# EAGLE design hd2 (EAGLE 6.3)

## Sheet 1 of 2
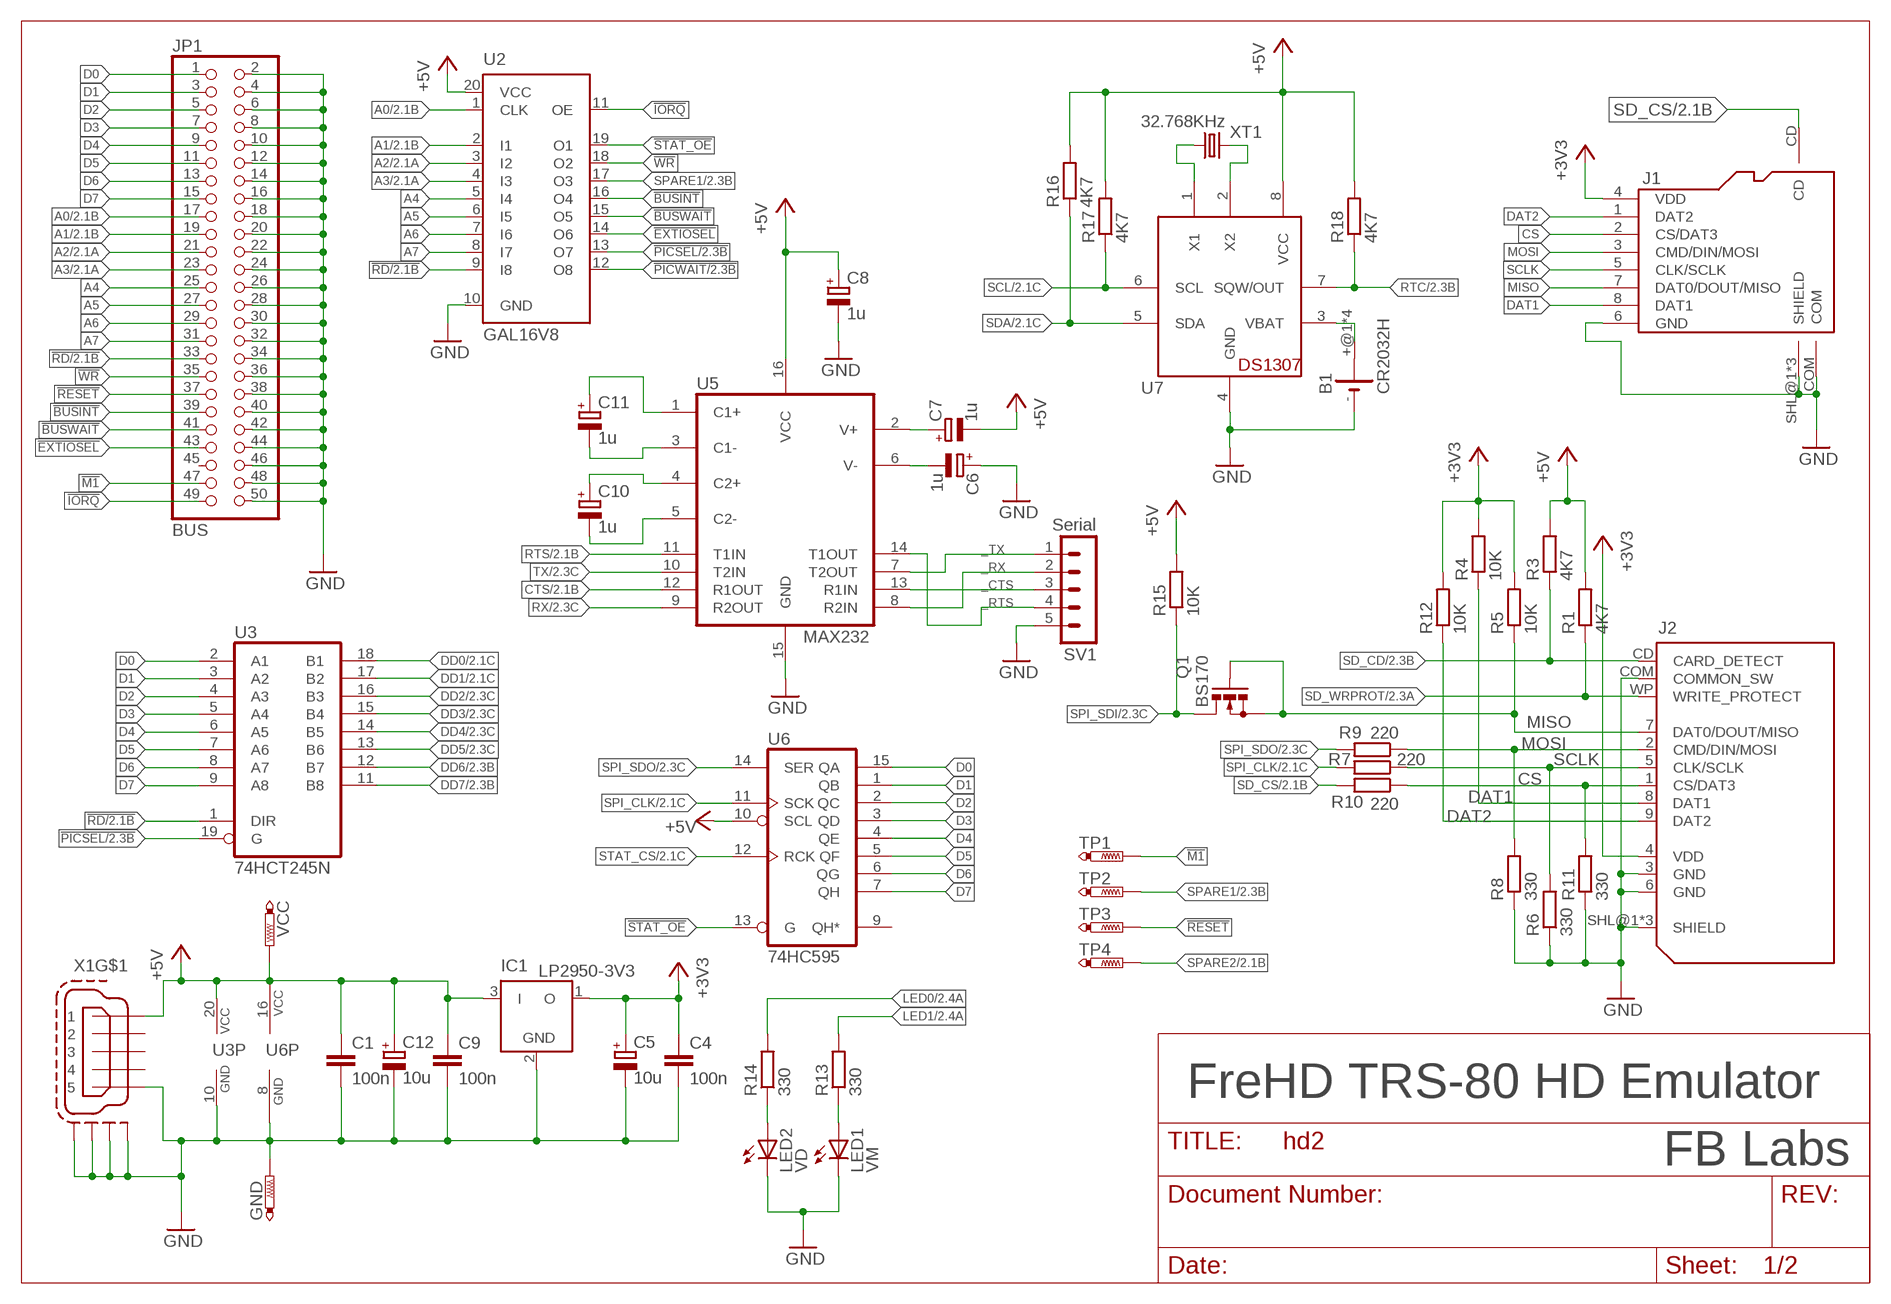
[diagram p0: schematic, sheet 1]

### Parts
B1  CR2032H  [CR2032H]
C1  100n  C-EU050-024X044  [C050-024X044]
C4  100n  C-EU050-024X044  [C050-024X044]
C5  10u  CPOL-EUE2-4  [E2-4]
C6  1u  CPOL-EUE2-4  [E2-4]
C7  1u  CPOL-EUE2-4  [E2-4]
C8  1u  CPOL-EUE2-4  [E2-4]
C9  100n  C-EU050-024X044  [C050-024X044]
C10  1u  CPOL-EUE2-4  [E2-4]
C11  1u  CPOL-EUE2-4  [E2-4]
C12  10u  CPOL-EUE2-4  [E2-4]
GND  PTR1B2,54  [B2,54]
IC1  LP2950-3V3  LP2950Z  [TO92]
J1  MICROSD-9P  [9P-SMD-W/-RING]
J2  SDMMC06132  [06132]
JP1  BUS  PINHD-2X25  [2X25]
LED1  VM  LED3MM  [LED3MM]
LED2  VD  LED3MM  [LED3MM]
Q1  BS170  [SOT54E]
R1  4K7  R-EU_0207/10  [0207/10]
R3  4K7  R-EU_0207/10  [0207/10]
R4  10K  R-EU_0207/10  [0207/10]
R5  10K  R-EU_0207/10  [0207/10]
R6  330  R-EU_0207/10  [0207/10]
R7  220  R-EU_0207/10  [0207/10]
R8  330  R-EU_0207/10  [0207/10]
R9  220  R-EU_0207/10  [0207/10]
R10  220  R-EU_0207/10  [0207/10]
R11  330  R-EU_0207/10  [0207/10]
R12  10K  R-EU_0207/10  [0207/10]
R13  330  R-EU_0207/10  [0207/10]
R14  330  R-EU_0207/10  [0207/10]
R15  10K  R-EU_0207/10  [0207/10]
R16  4K7  R-EU_0207/10  [0207/10]
R17  4K7  R-EU_0207/10  [0207/10]
R18  4K7  R-EU_0207/10  [0207/10]
SV1  Serial  MA05-1  [MA05-1]
TP1  PTR1PAD1-10  [P1-10]
TP2  PTR1PAD1-10  [P1-10]
TP3  PTR1PAD1-10  [P1-10]
TP4  PTR1PAD1-10  [P1-10]
U2  GAL16V8  ATF16V8BP3  [DIL20]
U3  74HCT245N  [DIL20]
U5  MAX232  MAX232PTH  [DIL16]
U6  74HC595  74LS595N  [DIL16]
U7  DS1307  [DIL08]
VCC  PTR1B2,54  [B2,54]
X1  MINI-USB-SCHIELD-32005-301  [32005-301]
XT1  32.768KHz  CRYSTALTC26V  [TC26V]

### Nets
!BUSINT: JP1.39 U2.16(O4)
!BUSWAIT: JP1.41 U2.15(O5)
!EXTIOSEL: JP1.43 U2.14(O6)
!IORQ: JP1.49 U2.11(OE)
!M1: JP1.47 TP1.TP
!PICSEL: U2.13(O7) U3.19(G) ; also sheet 2
!PICWAIT: U2.12(O8) ; also sheet 2
!RD: JP1.33 U2.9(I8) U3.1(DIR) ; also sheet 2
!RESET: JP1.37 TP3.TP
!STAT_OE: U2.19(O1) U6.13(G)
!WR: JP1.35 U2.18(O2)
+3V3 [power]: C4.1 C5.+ IC1.1(O) J1.4(VDD) J2.4(VDD) R4.2 R5.2 R12.2
+5V [power]: C1.1 C7.- C8.+ C9.1 C12.+ IC1.3(I) R1.2 R3.2 R15.2 R16.2 R17.2 R18.2 U2.20(VCC) U3.20(VCC) U5.16(VCC) U6.10(SCL) U6.16(VCC) U7.8(VCC) VCC.TP X1.1 ; also sheet 2
_CTS: SV1.3 U5.13(R1IN)
_RTS: SV1.4 U5.14(T1OUT)
_RX: SV1.2 U5.8(R2IN)
_TX: SV1.1 U5.7(T2OUT)
A0: JP1.17 U2.1(CLK) ; also sheet 2
A1: JP1.19 U2.2(I1) ; also sheet 2
A2: JP1.21 U2.3(I2) ; also sheet 2
A3: JP1.23 U2.4(I3) ; also sheet 2
A4: JP1.25 U2.5(I4)
A5: JP1.27 U2.6(I5)
A6: JP1.29 U2.7(I6)
A7: JP1.31 U2.8(I7)
CS: J1.2(CS/DAT3) J2.1(CS/DAT3) R10.1 R11.2
CTS: U5.12(R1OUT) ; also sheet 2
D0: JP1.1 U3.2(A1) U6.15(QA)
D1: JP1.3 U3.3(A2) U6.1(QB)
D2: JP1.5 U3.4(A3) U6.2(QC)
D3: JP1.7 U3.5(A4) U6.3(QD)
D4: JP1.9 U3.6(A5) U6.4(QE)
D5: JP1.11 U3.7(A6) U6.5(QF)
D6: JP1.13 U3.8(A7) U6.6(QG)
D7: JP1.15 U3.9(A8) U6.7(QH)
DAT1: J1.8(DAT1) J2.8(DAT1) R4.1
DAT2: J1.1(DAT2) J2.9(DAT2) R12.1
DD0: U3.18(B1) ; also sheet 2
DD1: U3.17(B2) ; also sheet 2
DD2: U3.16(B3) ; also sheet 2
DD3: U3.15(B4) ; also sheet 2
DD4: U3.14(B5) ; also sheet 2
DD5: U3.13(B6) ; also sheet 2
DD6: U3.12(B7) ; also sheet 2
DD7: U3.11(B8) ; also sheet 2
GND [power]: B1.- C1.2 C4.2 C5.- C6.+ C8.- C9.2 C12.- GND.TP IC1.2(GND) J1.6(GND) J1.COM J1.SHL@1(SHIELD) J1.SHL@2(SHIELD) J1.SHL@3(SHIELD) J2.3(GND) J2.6(GND) J2.COM(COMMON_SW) J2.SHL@1(SHIELD) J2.SHL@2(SHIELD) J2.SHL@3(SHIELD) JP1.2 JP1.4 JP1.6 JP1.8 JP1.10 JP1.12 JP1.14 JP1.16 JP1.18 JP1.20 JP1.22 JP1.24 JP1.26 JP1.28 JP1.30 JP1.32 JP1.34 JP1.36 JP1.38 JP1.40 JP1.42 JP1.44 JP1.46 JP1.48 JP1.50 LED1.K(C) LED2.K(C) R6.1 R8.1 R11.1 SV1.5 U2.10(GND) U3.10(GND) U5.15(GND) U6.8(GND) U7.4(GND) X1.5 X1.M1(S:S1) X1.M2(S:S2) X1.M3(S:S3) X1.M4(S:S4) ; also sheet 2
LED0: R14.2 ; also sheet 2
LED1: R13.2 ; also sheet 2
MISO: J1.7(DAT0/DOUT/MISO) J2.7(DAT0/DOUT/MISO) Q1.G Q1.S R5.1
MOSI: J1.3(CMD/DIN/MOSI) J2.2(CMD/DIN/MOSI) R8.2 R9.1
N$1: U7.1(X1) XT1.1
N$2: U7.2(X2) XT1.2
N$3: C6.- U5.6(V-)
N$4: C7.+ U5.2(V+)
N$6: B1.+@1(+) B1.+@2(+) B1.+@3(+) B1.+@4(+) U7.3(VBAT)
N$12: C11.- U5.3(C1-)
N$13: C11.+ U5.1(C1+)
N$14: C10.+ U5.4(C2+)
N$15: C10.- U5.5(C2-)
N$18: LED2.A R14.1
N$19: LED1.A R13.1
RTC: R18.1 U7.7(SQW/OUT) ; also sheet 2
RTS: U5.11(T1IN) ; also sheet 2
RX: U5.9(R2OUT) ; also sheet 2
SCL: R17.1 U7.6(SCL) ; also sheet 2
SCLK: J1.5(CLK/SCLK) J2.5(CLK/SCLK) R6.2 R7.1
SD_CD: J2.CD(CARD_DETECT) R3.1 ; also sheet 2
SD_CS: J1.CD R10.2 ; also sheet 2
SD_WRPROT: J2.WP(WRITE_PROTECT) R1.1 ; also sheet 2
SDA: R16.1 U7.5(SDA) ; also sheet 2
SPARE1: TP2.TP U2.17(O3) ; also sheet 2
SPARE2: TP4.TP ; also sheet 2
SPI_CLK: R7.2 U6.11(SCK) ; also sheet 2
SPI_SDI: Q1.D R15.1 ; also sheet 2
SPI_SDO: R9.2 U6.14(SER) ; also sheet 2
STAT_CS: U6.12(RCK) ; also sheet 2
TX: U5.10(T2IN) ; also sheet 2
Unconnected: JP1.45 U6.9(QH*) X1.2 X1.3 X1.4

### Notes on the sheet
- FreHD TRS-80 HD Emulator
- FB Labs

## Sheet 2 of 2
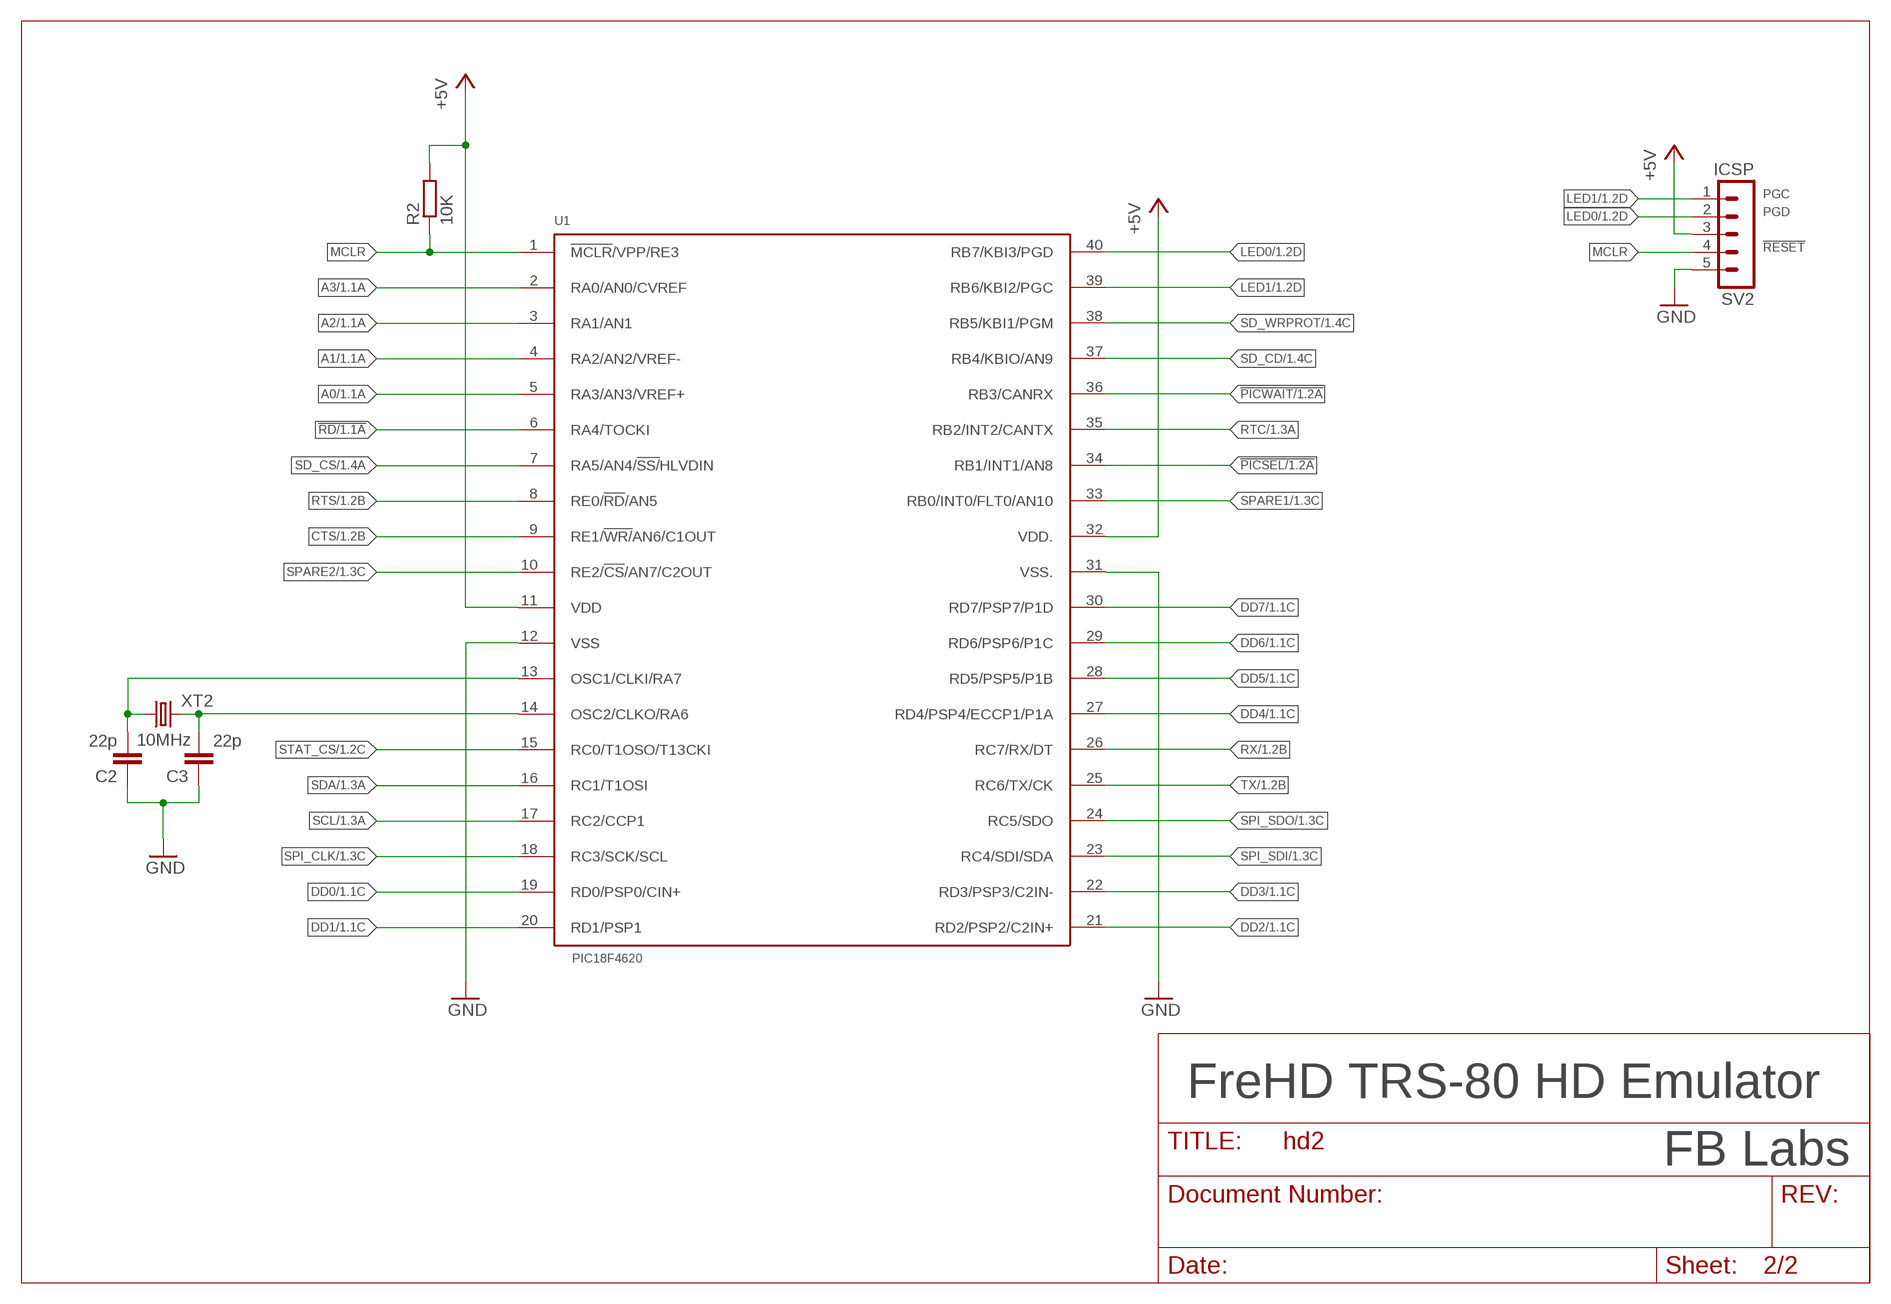
[diagram p1: schematic, sheet 2]

### Parts
C2  22p  C-EU050-024X044  [C050-024X044]
C3  22p  C-EU050-024X044  [C050-024X044]
R2  10K  R-EU_0207/10  [0207/10]
SV2  ICSP  MA05-1  [MA05-1]
U1  PIC18F4620  PIC18F4680  [PDIP-40]
XT2  10MHz  CRYSTALHC49U-V  [HC49U-V]

### Nets
!PICSEL: U1.34(RB1/INT1/AN8) ; also sheet 1
!PICWAIT: U1.36(RB3/CANRX) ; also sheet 1
!RD: U1.6(RA4/TOCKI) ; also sheet 1
+5V [power]: R2.2 SV2.3 U1.11(VDD) U1.32(VDD.) ; also sheet 1
A0: U1.5(RA3/AN3/VREF+) ; also sheet 1
A1: U1.4(RA2/AN2/VREF-) ; also sheet 1
A2: U1.3(RA1/AN1) ; also sheet 1
A3: U1.2(RA0/AN0/CVREF) ; also sheet 1
CTS: U1.9(RE1/!WR/!AN6/C1OUT) ; also sheet 1
DD0: U1.19(RD0/PSP0/CIN+) ; also sheet 1
DD1: U1.20(RD1/PSP1) ; also sheet 1
DD2: U1.21(RD2/PSP2/C2IN+) ; also sheet 1
DD3: U1.22(RD3/PSP3/C2IN-) ; also sheet 1
DD4: U1.27(RD4/PSP4/ECCP1/P1A) ; also sheet 1
DD5: U1.28(RD5/PSP5/P1B) ; also sheet 1
DD6: U1.29(RD6/PSP6/P1C) ; also sheet 1
DD7: U1.30(RD7/PSP7/P1D) ; also sheet 1
GND [power]: C2.1 C3.1 SV2.5 U1.12(VSS) U1.31(VSS.) ; also sheet 1
LED0: SV2.2 U1.40(RB7/KBI3/PGD) ; also sheet 1
LED1: SV2.1 U1.39(RB6/KBI2/PGC) ; also sheet 1
MCLR: R2.1 SV2.4 U1.1(!MCLR!/VPP/RE3)
N$28: C2.2 U1.13(OSC1/CLKI/RA7) XT2.1
N$29: C3.2 U1.14(OSC2/CLKO/RA6) XT2.2
RTC: U1.35(RB2/INT2/CANTX) ; also sheet 1
RTS: U1.8(RE0/!RD!/AN5) ; also sheet 1
RX: U1.26(RC7/RX/DT) ; also sheet 1
SCL: U1.17(RC2/CCP1) ; also sheet 1
SD_CD: U1.37(RB4/KBIO/AN9) ; also sheet 1
SD_CS: U1.7(RA5/AN4/!SS/!HLVDIN) ; also sheet 1
SD_WRPROT: U1.38(RB5/KBI1/PGM) ; also sheet 1
SDA: U1.16(RC1/T1OSI) ; also sheet 1
SPARE1: U1.33(RB0/INT0/FLT0/AN10) ; also sheet 1
SPARE2: U1.10(RE2/!CS!/AN7/C2OUT) ; also sheet 1
SPI_CLK: U1.18(RC3/SCK/SCL) ; also sheet 1
SPI_SDI: U1.23(RC4/SDI/SDA) ; also sheet 1
SPI_SDO: U1.24(RC5/SDO) ; also sheet 1
STAT_CS: U1.15(RC0/T1OSO/T13CKI) ; also sheet 1
TX: U1.25(RC6/TX/CK) ; also sheet 1

### Notes on the sheet
- PGC
- PGD
- !RESET
- FreHD TRS-80 HD Emulator
- FB Labs

## Library data of the parts
B1 = battery2:CR2032H: LI BATTERY Varta
C1-C4 C9 = rcl2:C-EU: CAPACITOR, European symbol
C5-C8 C10-C12 = rcl2:CPOL-EU: POLARIZED CAPACITOR, European symbol
GND VCC = testpad:PTR1: TEST PIN
IC1 = linear:LP2950: 100 mA, Low Power Low Dropout Voltage Regulator Source: http://www.onsemi.com/pub/Collateral/LP2950-D.PDF
J1 = SD-sockets:MICROSD-9P: Micro SD 9 pins
J2 = SD-sockets:SDMMC: SD MMC Card holder 4UCON part #06132 - easy to solder
JP1 = pinhead:PINHD-2X25: PIN HEADER
LED1 LED2 = led:LED: LED OSRAM: - CHIPLED LG R971, LG N971, LY N971, LG Q971, LY Q971, LO R971, LY R971 LH N974, LH R974 LS Q976, LO Q976, LY Q976 LO Q996 - Hyper CHIPLED LW Q18S LB Q993, LB Q99A, LB R99A - SideLED LS A670, LO A670, LY A670, LG A670, LP A670 LB A673, LV A673, LT A673, LW A673 LH A674 LY A675 LS A676, LA A676, LO A676, LY A676, LW A676 LS A679, LY A679, LG A679 - Hyper Micro SIDELED® LS Y876, LA Y876, LO Y876, LY Y876 LT Y87S - SmartLED LW L88C, LW L88S LB L89C, LB L89S, LG L890 LS L89K, LO L89K, LY L89K LS L896, LA L896, LO L896, LY L896 - TOPLED LS T670, LO T670, LY T670, LG T670, LP T670 LSG T670, LSP T670, LSY T670, LOP T670, LYG T670 LG T671, LOG T671, LSG T671 LB T673, LV T673, LT T673, LW T673 LH T674 LS T676, LA T676, LO T676, LY T676, LB T676, LH T676, LSB T676, LW T676 LB T67C, LV T67C, LT T67C, LS T67K, LO T67K, LY T67K, LW E67C LS E67B, LA E67B, LO E67B, LY E67B, LB E67C, LV E67C, LT E67C LW T67C LS T679, LY T679, LG T679 LS T770, LO T770, LY T770, LG T770, LP T770 LB T773, LV T773, LT T773, LW T773 LH T774 LS E675, LA E675, LY E675, LS T675 LS T776, LA T776, LO T776, LY T776, LB T776 LHGB T686 LT T68C, LB T68C - Hyper Mini TOPLED® LB M676 - Mini TOPLED Santana® LG M470 LS M47K, LO M47K, LY M47K Source: http://www.osram.convergy.de LUXEON: - LUMILED® LXK2-PW12-R00, LXK2-PW12-S00, LXK2-PW14-U00, LXK2-PW14-V00 LXK2-PM12-R00, LXK2-PM12-S00, LXK2-PM14-U00 LXK2-PE12-Q00, LXK2-PE12-R00, LXK2-PE12-S00, LXK2-PE14-T00, LXK2-PE14-U00 LXK2-PB12-K00, LXK2-PB12-L00, LXK2-PB12-M00, LXK2-PB14-N00, LXK2-PB14-P00, LXK2-PB14-Q00 LXK2-PR12-L00, LXK2-PR12-M00, LXK2-PR14-Q00, LXK2-PR14-R00 LXK2-PD12-Q00, LXK2-PD12-R00, LXK2-PD12-S00 LXK2-PH12-R00, LXK2-PH12-S00 LXK2-PL12-P00, LXK2-PL12-Q00, LXK2-PL12-R00 Source: www.luxeon.com KINGBRIGHT: KA-3528ASYC Source: www.kingbright.com
Q1 = transistor-small-signal:BS170: N-CHANNEL MOS FET
R1-R18 = rcl2:R-EU_: RESISTOR, European symbol
SV1 SV2 = con-lstb2:MA05-1: PIN HEADER; OC_FARNELL: unknown; OC_NEWARK: unknown
TP1-TP4 = testpad2:PTR1: TEST PIN
U1 = pic18f4680:PIC18F4680
U2 = atmel:ATF16V8B: High perfomance CMOS (electrically erasable) programmable logic device (PLD) ABLE-Atmel-ABEL - P18V8R, P16V8C, P16V8AS, P17V8 COPL Atmel-WinCUPL - G16V8MS, G16V8MA, G16V8AS, G16V8 LOG/IC - GAL16V8_R, GAL16V8_G7, GAL16V8_C), GAL16V8 Tango-PLD - G16V8R, G16V8C, G16V8AS, G16V8 Source: http://www.atmel.com/dyn/resources/prod_documents/DOC0364.PDF; MPN: ATF16V8CZ-15PU; OC_FARNELL: 1551768; OC_NEWARK: 94M6254
U3 = 74xx-eu:74*245: Octal BUS TRANSCEIVER, 3-state
U5 = SparkFun:MAX232: RS232 Transceiver Very common IC. This is generically called 'MAX232', but works with the 3V equivalent MAX3232 generic ICs. Field tested and mother approved. Spark Fun Electronics SKU : COM-00316 (DIP) and COM-00589 (SMD)
U6 = 74xx-us:74*595: 8-bit SHIFT REGISTER, output latch
U7 = adafruit:DS1307: DS1307 Real time clock (RTC) with battery backup ability. Talk to it via i2c
X1 = con-cypressindustries:MINI-USB-SCHIELD-: MINI USB-B Conector Source: www.cypressindustries.com; OC_FARNELL: unknown; OC_NEWARK: unknown
XT1 = crystal2:CRYSTAL: CRYSTAL; OC_FARNELL: unknown; OC_NEWARK: unknown
XT2 = crystal2:CRYSTAL: CRYSTAL; OC_FARNELL: 1666969; OC_NEWARK: unknown

## Net classes
0 default: width 0.305 mm, drill 0.584 mm, clearance 0.203 mm
1 power: width 0.406 mm, drill 0.762 mm, clearance 0.203 mm

## Board
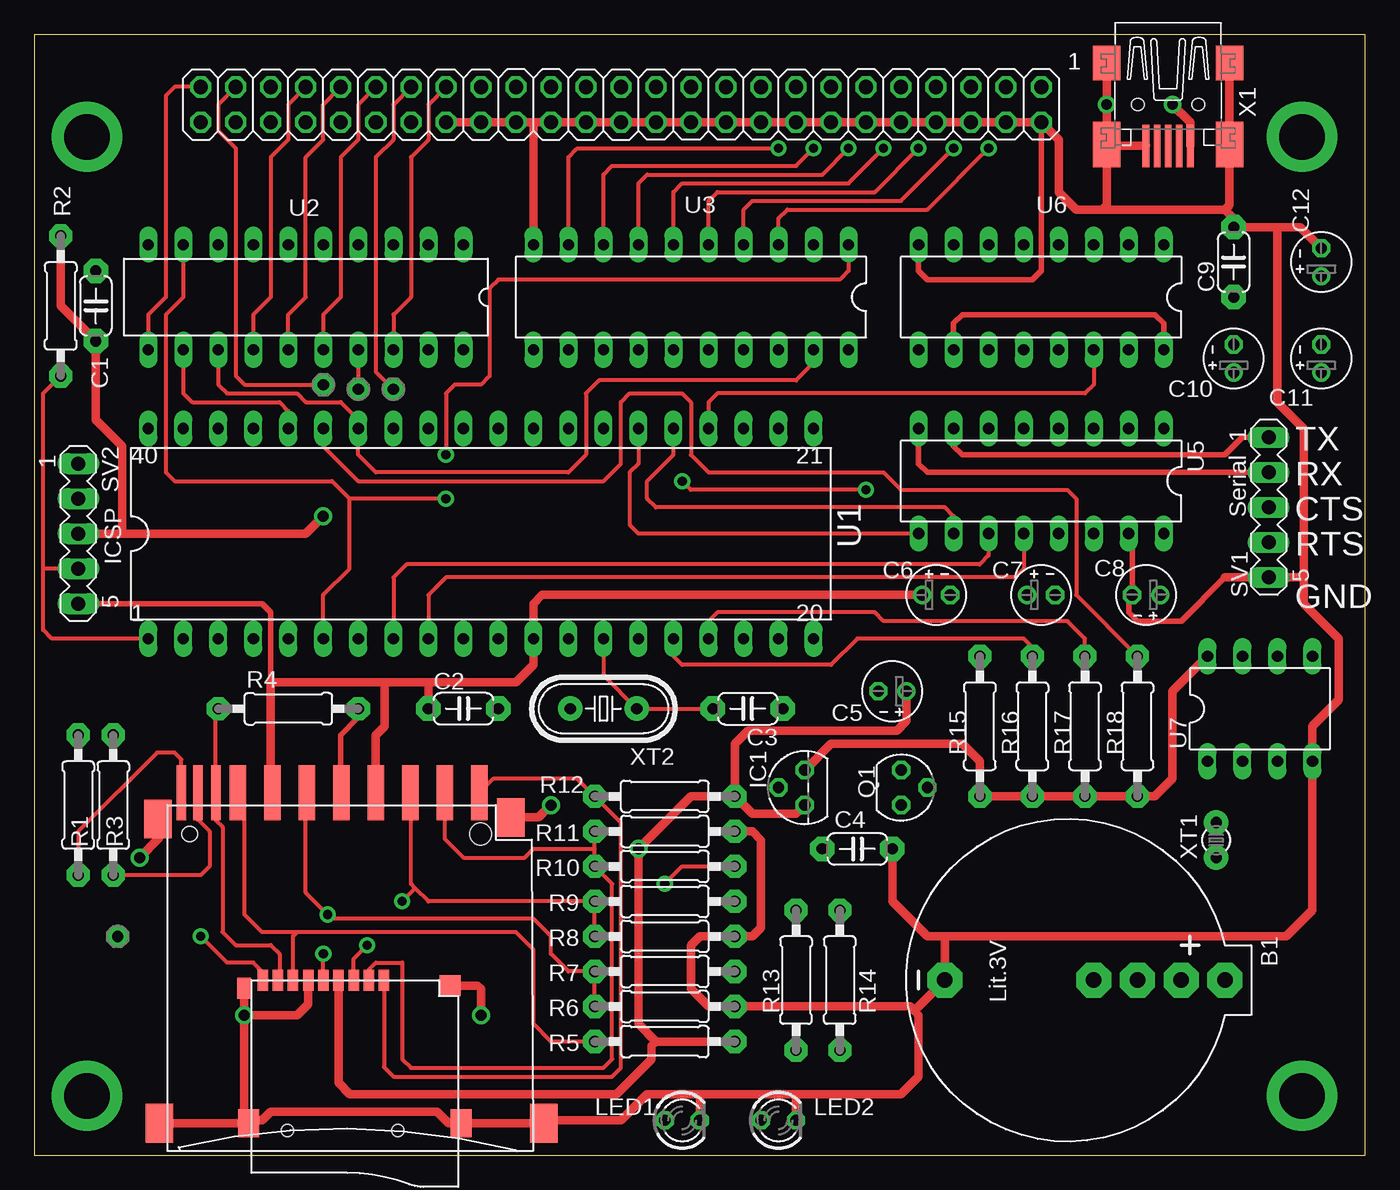
[diagram p2: board, top side]
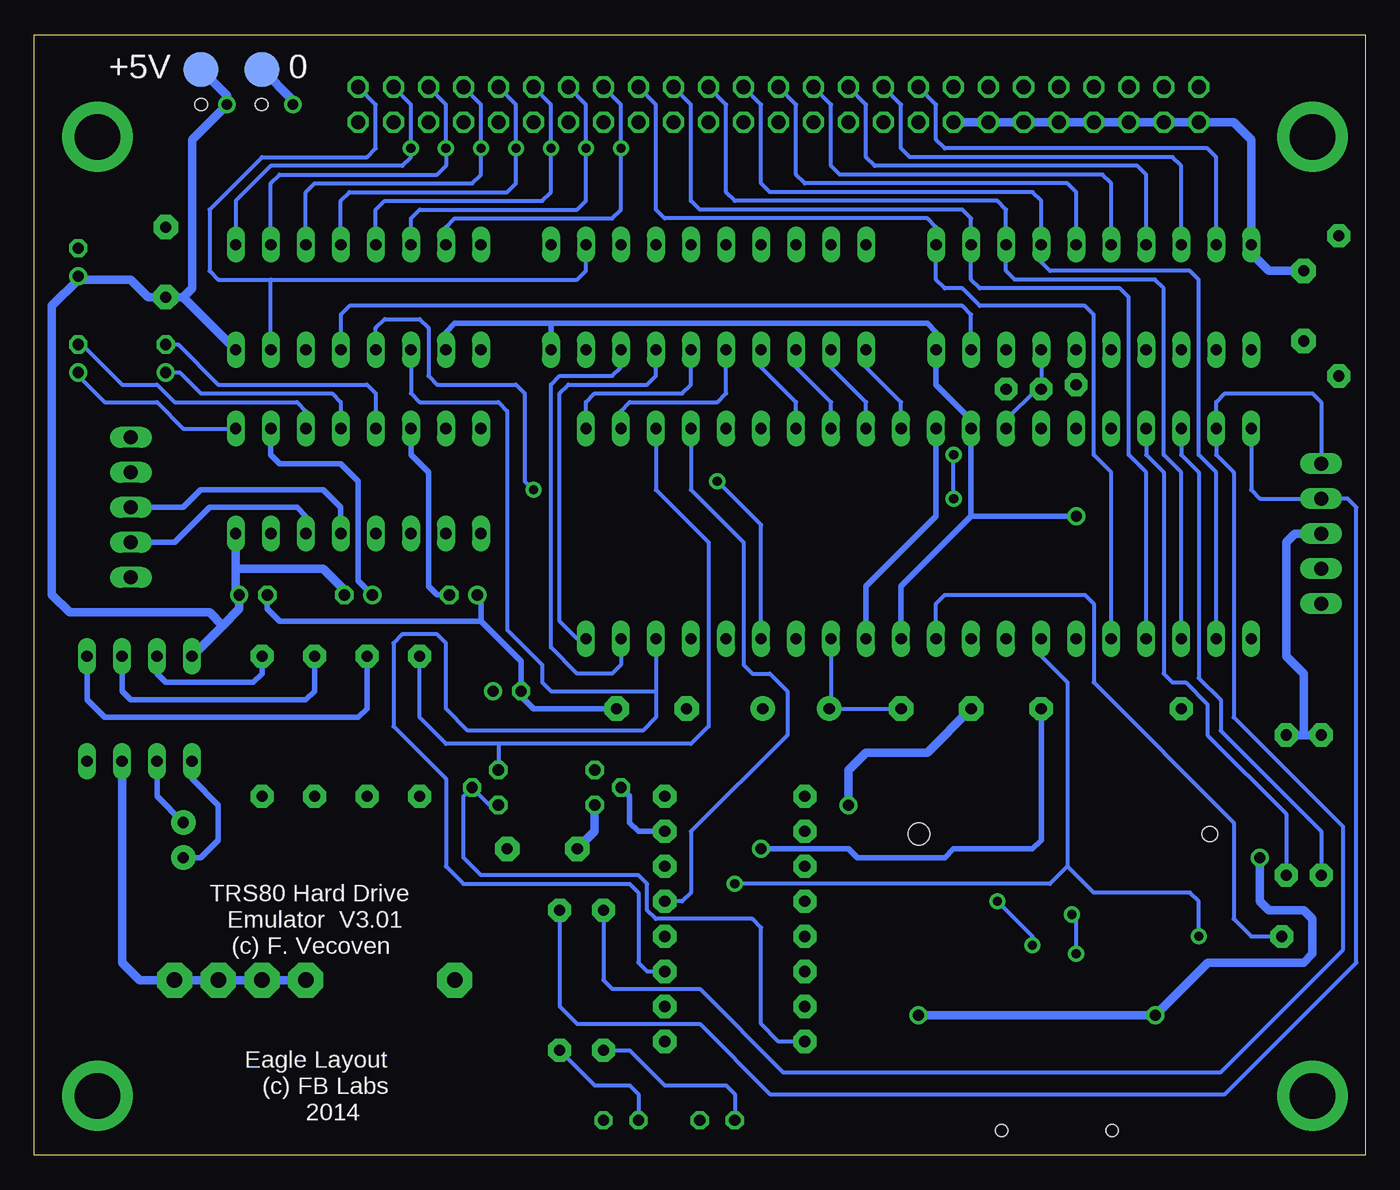
[diagram p3: board, bottom side, seen from below]

Size 96.52 x 81.25 mm. Coordinates in mm from the lower left corner, seen from the top.
Outline: 0,0 96.52,0 96.52,81.25 0,81.25 0,0
Copper layers (1*16): Top 0.035mm / dielectric 1.5mm / Bottom 0.035mm
Design rules "SparkFun(8mil) *": minimum track width 10mil, minimum drill 20mil, track to track 8mil, track to pad 8mil, pad to pad 8mil, via to via 8mil, smd to smd 8mil, copper to edge 10mil, drill to drill 8mil, minimum pad ring 10mil, minimum via ring 10mil, stop-mask expansion 4mil, vias tented up to drill 25mil, thermal gap 10mil

### Footprints (pad centres in the part's own frame; a part is rotated, then mirrored left to right if it is on the bottom)
CR2032H = drill 1.118 pad 2.54 octagon: +@1 0,12.065; +@2 0,8.89; +@3 0,5.715; +@4 0,2.54; - 0,-8.255
C050-024X044 = drill 0.813 pad 1.778 octagon: 1 -2.54,0; 2 2.54,0
E2-4 = drill 0.813 pad 1.27: + -1.016,0 | drill 0.813 pad 1.27 octagon: - 1.016,0
B2,54 = smd 2.54 x 2.54: TP 0,0
TO92 = drill 0.813 octagon: 1 -1.27,0; 2 0,1.905; 3 1.27,0
9P-SMD-W/-RING = smd 1.524 x 0.762: 1 0,4.4; 2 0,3.3; 3 0,2.2; 4 0,1.1; 5 0,0; 6 0,-1.1; 7 0,-2.2; 8 0,-3.3; CD 0,-4.4 | smd 1.524 x 1.016: COM 0.6,-5.746 | smd 1.524 x 1.524: SHL@1 0.392,9.181 | smd 2.032 x 1.524: SHL@2 10.373,10; SHL@3 10.373,-5.4 | hole 0.889: 10.9,-2.6; 10.9,5.4
06132 = smd 1.2 x 4: 1 6.9,0.9; 2 4.4,0.9; 3 1.9,0.9; 4 -0.6,0.9; 5 -3.1,0.9; 6 -5.6,0.9; 7 -8.1,0.9; 9 9.4,0.9 | smd 0.7 x 4: 8 -9.7,0.9; CD -11,0.9; WP -12.2,0.9 | smd 2 x 2.8: COM 11.7,-0.9; SHL@1 -13.9,-1; SHL@2 -13.8,-23.07; SHL@3 14.1,-23.07 | hole 1.1: -11.6,-2.1 | hole 1.6: 9.5,-2.1
2X25 = drill 1.016 octagon: 1 -30.48,-1.27; 2 -30.48,1.27; 3 -27.94,-1.27; 4 -27.94,1.27; 5 -25.4,-1.27; 6 -25.4,1.27; 7 -22.86,-1.27; 8 -22.86,1.27; 9 -20.32,-1.27; 10 -20.32,1.27; 11 -17.78,-1.27; 12 -17.78,1.27; 13 -15.24,-1.27; 14 -15.24,1.27; 15 -12.7,-1.27; 16 -12.7,1.27; 17 -10.16,-1.27; 18 -10.16,1.27; 19 -7.62,-1.27; 20 -7.62,1.27; 21 -5.08,-1.27; 22 -5.08,1.27; 23 -2.54,-1.27; 24 -2.54,1.27; 25 0,-1.27; 26 0,1.27; 27 2.54,-1.27; 28 2.54,1.27; 29 5.08,-1.27; 30 5.08,1.27; 31 7.62,-1.27; 32 7.62,1.27; 33 10.16,-1.27; 34 10.16,1.27; 35 12.7,-1.27; 36 12.7,1.27; 37 15.24,-1.27; 38 15.24,1.27; 39 17.78,-1.27; 40 17.78,1.27; 41 20.32,-1.27; 42 20.32,1.27; 43 22.86,-1.27; 44 22.86,1.27; 45 25.4,-1.27; 46 25.4,1.27; 47 27.94,-1.27; 48 27.94,1.27; 49 30.48,-1.27; 50 30.48,1.27
LED3MM = drill 0.813 octagon: A -1.27,0; K 1.27,0
SOT54E = drill 0.813 octagon: D -1.27,0; G 0,1.905; S 1.27,0
0207/10 = drill 0.813 pad 1.676 octagon: 1 -5.08,0; 2 5.08,0
MA05-1 = drill 1.016 long: 1 -5.08,0; 2 -2.54,0; 3 0,0; 4 2.54,0; 5 5.08,0
P1-10 = drill 0.813 pad 1.651 octagon: TP 0,0
PDIP-40 = drill 0.813 long: 1 -19.05,-8.89; 2 -16.51,-8.89; 3 -13.97,-8.89; 4 -11.43,-8.89; 5 -8.89,-8.89; 6 -6.35,-8.89; 7 -3.81,-8.89; 8 -1.27,-8.89; 9 1.27,-8.89; 10 3.81,-8.89; 11 6.35,-8.89; 12 8.89,-8.89; 13 11.43,-8.89; 14 13.97,-8.89; 15 16.51,-8.89; 16 19.05,-8.89; 17 21.59,-8.89; 18 24.13,-8.89; 19 26.67,-8.89; 20 29.21,-8.89; 21 29.21,6.35; 22 26.67,6.35; 23 24.13,6.35; 24 21.59,6.35; 25 19.05,6.35; 26 16.51,6.35; 27 13.97,6.35; 28 11.43,6.35; 29 8.89,6.35; 30 6.35,6.35; 31 3.81,6.35; 32 1.27,6.35; 33 -1.27,6.35; 34 -3.81,6.35; 35 -6.35,6.35; 36 -8.89,6.35; 37 -11.43,6.35; 38 -13.97,6.35; 39 -16.51,6.35; 40 -19.05,6.35
DIL20 = drill 0.813 long: 1 -11.43,-3.81; 2 -8.89,-3.81; 3 -6.35,-3.81; 4 -3.81,-3.81; 5 -1.27,-3.81; 6 1.27,-3.81; 7 3.81,-3.81; 8 6.35,-3.81; 9 8.89,-3.81; 10 11.43,-3.81; 11 11.43,3.81; 12 8.89,3.81; 13 6.35,3.81; 14 3.81,3.81; 15 1.27,3.81; 16 -1.27,3.81; 17 -3.81,3.81; 18 -6.35,3.81; 19 -8.89,3.81; 20 -11.43,3.81
DIL16 = drill 0.813 long: 1 -8.89,-3.81; 2 -6.35,-3.81; 3 -3.81,-3.81; 4 -1.27,-3.81; 5 1.27,-3.81; 6 3.81,-3.81; 7 6.35,-3.81; 8 8.89,-3.81; 9 8.89,3.81; 10 6.35,3.81; 11 3.81,3.81; 12 1.27,3.81; 13 -1.27,3.81; 14 -3.81,3.81; 15 -6.35,3.81; 16 -8.89,3.81
DIL08 = drill 0.813 long: 1 -3.81,-3.81; 2 -1.27,-3.81; 3 1.27,-3.81; 4 3.81,-3.81; 5 3.81,3.81; 6 1.27,3.81; 7 -1.27,3.81; 8 -3.81,3.81
32005-301 = smd 3.1 x 0.5: 1 3,1.6; 2 3,0.8; 3 3,0; 4 3,-0.8; 5 3,-1.6 | smd 2.5 x 2: M1 -3,-4.45; M2 -3,4.45 | smd 3.3 x 2: M3 2.9,4.45; M4 2.9,-4.45 | hole 0.9: 0,2.2; 0,-2.2
TC26V = drill 0.813 pad 1.778: 1 -1.27,0; 2 1.27,0
HC49U-V = drill 0.813 pad 1.778: 1 -2.413,0; 2 2.413,0

### Placement (x,y rotation side)
B1  74.3,12.7 270 top
C1  4.45,61.59 90 top
C2  31.11,32.38 0 top
C3  51.75,32.38 180 top
C4  59.69,22.23 0 top
C5  62.23,33.66 180 top
C6  65.41,40.64 0 top
C7  73.03,40.64 0 top
C8  80.64,40.64 180 top
C9  87,64.77 90 top
C10  87,57.78 90 top
C11  93.34,57.78 90 top
C12  93.34,64.77 90 top
GND  80.01,78.74 0 bottom
IC1  55.88,26.67 90 top
J1  20.95,12.7 270 top
J2  22.86,25.4 0 top
JP1  42.55,76.2 180 top
LED1  46.99,2.54 0 top
LED2  53.98,2.54 0 top
Q1  62.87,26.67 270 top
R1  3.17,25.4 90 top
R2  1.91,61.59 90 top
R3  5.71,25.4 90 top
R4  18.41,32.38 0 top
R5  45.72,8.26 0 top
R6  45.72,10.79 180 top
R7  45.72,13.34 0 top
R8  45.72,15.88 180 top
R9  45.72,18.41 0 top
R10  45.72,20.95 0 top
R11  45.72,23.5 180 top
R12  45.72,26.04 0 top
R13  55.24,12.7 90 top
R14  58.42,12.7 90 top
R15  68.58,31.11 270 top
R16  72.39,31.11 270 top
R17  76.2,31.11 270 top
R18  80.01,31.11 270 top
SV1  89.53,46.99 270 top
SV2  3.17,45.09 270 top
TP1  20.95,55.88 0 top
TP2  23.5,55.56 0 top
TP3  26.04,55.56 0 top
TP4  6.03,15.88 0 top
U1  27.3,46.35 0 top
U2  19.68,62.23 180 top
U3  47.62,62.23 180 top
U5  73.03,48.9 180 top
U6  73.03,62.23 180 top
U7  88.9,32.38 0 top
VCC  84.45,78.74 0 bottom
X1  82.23,76.2 270 top
XT1  85.72,22.86 90 top
XT2  41.27,32.38 0 top

### Tracks (layer width: path | path; a pad name or v marks a point on that pad's centre or on a via)
!BUSINT
  Top 0.305: JP1.39 23.5,76.2 23.5,73.66 22.23,72.39 22.23,62.23 20.95,60.96 U2.16
!BUSWAIT
  Top 0.305: U2.15 18.41,60.96 19.68,62.23 19.68,72.39 20.95,73.66 20.95,76.2 JP1.41
!EXTIOSEL
  Top 0.305: JP1.43 18.41,76.2 18.41,73.66 17.14,72.39 17.14,62.23 15.88,60.96 U2.14
!IORQ
  Top 0.305: JP1.49 10.16,77.47 9.53,76.83 9.53,62.23 8.26,60.96 U2.11
!M1
  Top 0.305: JP1.47 13.34,76.2 13.34,74.3 14.61,73.03 14.61,56.52 15.24,55.88 TP1.TP
!PICSEL
  Top 0.305: U2.13 13.34,55.88 13.97,55.24 19.05,55.24 19.68,54.61 22.23,54.61 23.5,53.34 U1.34 23.5,50.8 24.77,49.53 38.73,49.53 40.01,50.8 40.01,55.24 40.96,56.2 55.24,56.2 56.52,57.47 U3.19
!PICWAIT
  Top 0.305: U2.12 10.79,55.24 11.43,54.61 17.78,54.61 18.41,53.98 U1.36
!RD  (via drill 0.66)
  Top 0.305: U2.9 10.79,62.23 9.53,60.96 9.53,49.53 10.16,48.9 21.59,48.9 22.86,47.62 | U1.6 20.95,40.64 22.86,42.55 22.86,47.62 | U3.1 59.05,64.14 58.42,63.5 33.66,63.5 33.02,62.87 33.02,56.52 32.38,55.88 30.48,55.88 29.84,55.24 v29.84,50.8 | v29.84,47.62 22.86,47.62
  Bottom 0.305: U2.9 10.79,72.39 11.43,73.03 30.48,73.03 31.11,73.66 31.11,76.2 JP1.33 | v29.84,47.62 v29.84,50.8
!RESET
  Top 0.305: JP1.37 26.04,76.2 26.04,73.66 24.77,72.39 24.77,56.83 TP3.TP
!STAT_OE
  Bottom 0.305: U2.19 28.57,60.96 29.21,61.59 73.66,61.59 74.3,60.96 U6.13
!WR
  Top 0.305: JP1.35 28.57,76.2 28.57,73.66 27.3,72.39 27.3,62.23 26.04,60.96 U2.18
+3V3  (via drill 0.8)
  Top 0.406: R4.2 23.5,31.75 22.23,30.48 22.23,26.34 J2.4
  Top 0.61: C5.+ 63.25,31.5 62.55,30.8 51.75,30.8 50.8,29.84 R12.2 | IC1.1 55.24,24.77 52.07,24.77 R12.2 | R12.2 47.62,26.04 v43.81,22.23 43.81,9.53 45.09,8.26 | R5.2 45.09,8.26 | J1.4 22.05,5.25 22.86,4.45 42.23,4.45 44.77,6.99 44.77,7.94 45.09,8.26
  Bottom 0.406: v43.81,22.23 37.47,22.23 36.83,21.59 30.48,21.59 29.84,22.23 24.13,22.23 23.5,22.86 R4.2
  Bottom 0.61: IC1.1 55.88,23.5 C4.1
+5V  (via drill 0.76, 0.8)
  Top 0.406: U6.16 81.92,60.33 81.28,60.96 67.31,60.96 66.67,60.33 U6.10
  Top 0.61: IC1.3 57.78,29.84 67.31,29.84 68.58,28.57 R15.2 R16.2 R17.2 R18.2 81.28,26.04 82.55,27.3 82.55,33.66 U7.8 | v20.95,46.35 19.68,45.09 6.35,45.09 | 6.35,45.09 SV2.3 | 6.35,45.09 6.35,51.44 4.45,53.34 C1.1 1.91,61.59 R2.2 | X1.1 83.83,74.92 v82.55,76.2
  Bottom 0.406: U6.10 66.67,59.69 66.04,60.33 59.05,60.33 | 59.05,60.33 31.75,60.33 31.11,59.69 U2.20 31.11,55.88 28.57,53.34 U1.32 28.57,46.35 | U3.20 59.05,60.33 | 93.09,63.5 C12.+ 93.34,63.5 | 28.57,46.35 33.66,41.27 U1.11 | 28.57,46.35 v20.95,46.35
  Bottom 0.61: U5.16 81.92,42.55 | 81.92,42.55 81.92,40.89 C8.+ 81.66,39.62 82.87,38.42 | 82.87,38.42 U7.8 | C7.- 74.04,41.02 75.56,42.55 81.92,42.55 | U6.16 85.72,62.23 | 85.72,62.23 C9.1 88.27,62.23 89.53,63.5 93.09,63.5 | 93.34,63.5 95.25,61.59 95.25,40.64 93.98,39.37 83.82,39.37 82.87,38.42 | SV2.3 5.08,45.09 5.71,44.45 5.71,36.2 4.45,34.92 4.45,30.48 | 4.45,30.48 R3.2 | R1.2 4.45,30.48 | 85.72,62.23 85.09,62.87 85.09,73.66 v82.55,76.2 82.55,76.83 VCC.TP
_CTS
  Bottom 0.406: SV1.3 85.72,46.99 84.45,48.26 75.56,48.26 74.3,46.99 U5.13
_RTS
  Bottom 0.406: SV1.4 86.36,44.45 83.82,46.99 77.47,46.99 76.83,46.35 U5.14
_RX
  Top 0.406: SV1.2 64.77,49.53 64.14,50.16 U5.8
_TX
  Top 0.406: SV1.1 87.63,52.07 86.36,50.8 67.31,50.8 66.67,51.44 U5.7
A0
  Bottom 0.305: JP1.17 51.44,76.2 51.44,68.58 50.8,67.94 31.75,67.94 31.11,67.31 U2.1 31.11,63.5 30.48,62.87 29.21,62.87 27.94,61.59 20.32,61.59 19.68,60.96 19.68,50.8 18.41,49.53 U1.5
A1
  Bottom 0.305: JP1.19 48.9,76.2 48.9,69.22 48.26,68.58 29.21,68.58 28.57,67.94 U2.2 28.57,63.5 27.94,62.87 17.78,62.87 17.14,62.23 17.14,50.8 15.88,49.53 U1.4
A2
  Bottom 0.305: JP1.21 46.35,76.2 46.35,69.85 45.72,69.22 26.67,69.22 26.04,68.58 U2.3 26.04,64.14 25.4,63.5 15.24,63.5 14.61,62.87 14.61,50.8 13.34,49.53 U1.3
A3
  Bottom 0.305: JP1.23 43.81,76.2 43.81,70.48 43.18,69.85 24.13,69.85 23.5,69.22 U2.4 23.5,64.77 22.86,64.14 12.7,64.14 12.06,63.5 12.06,50.8 10.79,49.53 U1.2
A4
  Bottom 0.305: U2.5 20.95,69.85 21.59,70.48 40.64,70.48 41.27,71.12 41.27,76.2 JP1.25
A5
  Bottom 0.305: U2.6 18.41,70.48 19.05,71.12 38.1,71.12 38.73,71.75 38.73,76.2 JP1.27
A6
  Bottom 0.305: U2.7 15.88,71.12 16.51,71.75 35.56,71.75 36.2,72.39 36.2,76.2 JP1.29
A7
  Bottom 0.305: U2.8 13.34,71.75 13.97,72.39 33.02,72.39 33.66,73.03 33.66,76.2 JP1.31
CS
  Top 0.305: 40.64,22.23 R10.1 41.91,19.68 41.91,6.99 41.27,6.35 27.3,6.35 26.67,6.99 26.67,13.97 24.77,13.97 24.25,13.46 J1.2 | 40.64,22.23 R11.2 | J2.1 29.76,22.95 31.11,21.59 35.56,21.59 36.2,22.23 40.64,22.23
CTS
  Top 0.305: U5.12 71.75,42.55 71.12,41.91 29.84,41.91 28.57,40.64 U1.9
D0
  Bottom 0.305: 79.38,63.5 83.19,63.5 83.82,64.14 83.82,68.58 80.01,72.39 72.39,72.39 71.75,73.03 71.75,76.2 JP1.1 | 79.38,63.5 57.15,63.5 56.52,64.14 U3.2 | U6.15 79.38,63.5
D1  (via drill 0.66)
  Top 0.305: U3.3 53.98,67.94 54.61,68.58 64.77,68.58 v69.22,73.03
  Bottom 0.305: JP1.3 69.22,76.2 v69.22,73.03 69.22,72.39 69.85,71.75 79.38,71.75 81.92,69.22 U6.1
D2  (via drill 0.66)
  Top 0.305: U3.4 51.44,68.58 52.07,69.22 62.87,69.22 v66.67,73.03
  Bottom 0.305: U6.2 79.38,70.48 78.74,71.12 67.31,71.12 66.67,71.75 v66.67,73.03 66.67,76.2 JP1.5
D3  (via drill 0.66)
  Top 0.305: U3.5 48.9,69.22 49.53,69.85 60.96,69.85 v64.14,73.03
  Bottom 0.305: U6.3 76.83,69.85 76.2,70.48 64.77,70.48 64.14,71.12 v64.14,73.03 64.14,76.2 JP1.7
D4  (via drill 0.66)
  Top 0.305: U3.6 46.35,69.85 46.99,70.48 59.05,70.48 v61.59,73.03
  Bottom 0.305: U6.4 74.3,69.22 73.66,69.85 62.23,69.85 61.59,70.48 v61.59,73.03 61.59,76.2 JP1.9
D5  (via drill 0.66)
  Top 0.305: U3.7 43.81,70.48 44.45,71.12 57.15,71.12 v59.05,73.03
  Bottom 0.305: U6.5 71.75,68.58 71.12,69.22 59.69,69.22 59.05,69.85 v59.05,73.03 59.05,76.2 JP1.11
D6  (via drill 0.66)
  Top 0.305: U3.8 41.27,71.12 41.91,71.75 55.24,71.75 v56.52,73.03
  Bottom 0.305: U6.6 69.22,67.94 68.58,68.58 57.15,68.58 56.52,69.22 v56.52,73.03 56.52,76.2 JP1.13
D7  (via drill 0.66)
  Top 0.305: U3.9 38.73,72.39 39.37,73.03 v53.98,73.03
  Bottom 0.305: U6.7 66.67,67.31 66.04,67.94 54.61,67.94 53.98,68.58 v53.98,73.03 53.98,76.2 JP1.15
DAT1
  Top 0.305: R4.1 13.16,32.21 J2.8 13.16,24.3 13.65,23.81 13.65,16.19 14.61,15.24 17.14,15.24 17.78,14.61 17.78,12.82 J1.8
DAT2
  Top 0.305: J2.9 33.27,27.3 39.37,27.3 R12.1 42.55,24.13 42.55,6.35 41.91,5.71 26.04,5.71 25.36,6.39 J1.1
DD0
  Bottom 0.305: U1.19 53.98,35.56 54.61,34.92 57.15,34.92 59.05,36.83 59.05,55.88 58.42,56.52 54.61,56.52 53.98,57.15 U3.18
DD1
  Bottom 0.305: U1.20 57.15,37.47 58.42,38.73 58.42,55.24 57.78,55.88 52.07,55.88 51.44,56.52 U3.17
DD2
  Bottom 0.305: U1.21 56.52,54.61 55.88,55.24 49.53,55.24 48.9,55.88 U3.16
DD3
  Bottom 0.305: U1.22 53.98,53.98 53.34,54.61 46.99,54.61 46.35,55.24 U3.15
DD4
  Bottom 0.305: U1.27 41.27,54.61 43.81,57.15 U3.14
DD5
  Bottom 0.305: U1.28 38.73,54.61 41.27,57.15 U3.13
DD6
  Bottom 0.305: U1.29 36.2,54.61 38.73,57.15 U3.12
DD7
  Bottom 0.305: U1.30 33.66,54.61 36.2,57.15 U3.11
GND  (via drill 0.76, 0.8)
  Top 0.406: U5.15 79.63,44.83 C8.- 79.38,40.39 79.38,39.37 80.01,38.73 83.19,38.73 86.36,41.91 | SV2.5 16.51,40.01 17.14,39.37 17.14,34.29 | 17.14,26.41 J2.6 | J2.3 | U6.8 64.14,64.14 64.77,63.5 72.39,63.5 73.03,64.14 JP1.2
  Top 0.61: JP1.36 JP1.34 JP1.32 | JP1.32 JP1.30 JP1.28 JP1.26 JP1.24 JP1.22 JP1.20 JP1.18 JP1.16 JP1.14 JP1.12 JP1.10 JP1.8 JP1.6 JP1.4 JP1.2 74.3,73.66 74.3,69.85 75.56,68.58 77.47,68.58 | 90.17,67.31 C9.2 87,67.94 86.36,68.58 | 90.17,67.31 91.82,67.31 C12.- | 90.17,67.31 90.17,54.61 92.08,52.7 92.08,41.91 | 92.08,41.91 92.08,40.01 94.61,37.47 94.61,33.02 92.71,31.11 U7.4 92.71,17.78 90.81,15.88 66.04,15.88 | 92.08,41.91 SV1.5 86.36,41.91 | 66.04,15.88 64.77,15.88 62.23,18.41 C4.2 | LED1.K 48.26,4.45 | 48.26,4.45 55.24,4.45 | 55.24,4.45 LED2.K | 55.24,4.45 62.87,4.45 64.14,5.71 64.14,10.16 63.82,10.48 | 63.82,10.48 63.5,10.79 R6.1 48.9,10.79 47.62,12.06 47.62,15.24 48.26,15.88 R8.1 52.07,15.88 52.7,16.51 52.7,22.86 52.07,23.5 R11.1 | 48.26,4.45 44.45,4.45 42.55,2.54 37.17,2.54 J2.SHL@3 J1.SHL@2 30.06,2.33 29.21,3.17 17.14,3.17 16.51,2.54 15.77,2.54 J1.SHL@3 | 17.14,26.41 17.14,34.29 25.4,34.29 | 25.4,34.29 25.4,31.11 24.77,30.48 J2.3 | 25.4,34.29 28.57,34.29 | 28.57,34.29 C2.1 | 28.57,34.29 34.92,34.29 36.2,35.56 U1.12 36.2,40.01 36.83,40.64 C6.+ | JP1.32 36.2,74.93 U3.10 | J2.COM 36.56,24.5 v37.47,25.4 | 66.04,15.88 B1.- 63.82,10.48 | 86.36,68.58 77.47,68.58 | X1.M2 X1.M3 86.68,68.9 86.36,68.58 | X1.M4 77.78,68.89 77.47,68.58 | X1.5 77.88,73.2 X1.M4 | J2.SHL@1 9.06,24.3 9.06,23.03 v7.62,21.59 | J1.SHL@3 J2.SHL@2 | J1.COM v15.21,10.16 | v15.21,10.16 15.21,2.67 J1.SHL@3 | J1.6 19.86,10.96 19.05,10.16 v15.21,10.16 | J1.SHL@1 32.14,12.31 32.38,12.06 v32.38,10.16 | X1.M4 v77.78,76.19 v77.79,76.2 v77.78,76.2 X1.M1
  Bottom 0.406: U1.31 31.11,46.35 36.2,41.27 U1.12 | 64.14,38.73 78.74,38.73 79.63,39.62 C8.- | 64.14,38.73 64.14,40.39 C6.+ | 64.14,38.73 61.21,35.81 C5.- 61.21,33.27 60.33,32.38 C3.1 | R11.1 52.7,23.5 53.34,24.13 53.34,26.04 IC1.2
  Bottom 0.61: JP1.36 JP1.38 JP1.40 JP1.42 JP1.44 JP1.46 JP1.48 JP1.50 9.53,74.93 8.26,73.66 U2.10 8.26,65.41 6.99,64.14 C1.2 | v37.47,25.4 37.47,27.94 36.2,29.21 31.75,29.21 C2.1 | GND.TP 77.79,76.52 v77.79,76.2 | v32.38,10.16 v15.21,10.16 11.4,13.97 4.45,13.97 3.81,14.61 3.81,17.14 4.45,17.78 6.99,17.78 7.62,18.41 v7.62,21.59
HOLES  (via drill 3.3 pad 5.08)
  other vias: 91.95,73.85
LED0
  Bottom 0.305: U1.40 8.26,48.26 7.62,47.62 SV2.2 1.27,47.62 0.64,46.99 0.64,13.97 10.16,4.45 43.18,4.45 48.26,9.53 57.15,9.53 58.42,10.79 R14.2
LED1
  Bottom 0.305: SV2.1 3.17,54.61 3.81,55.24 10.16,55.24 10.79,54.61 U1.39 10.79,50.8 9.53,49.53 9.53,31.75 1.59,23.81 1.59,14.92 10.48,6.03 42.23,6.03 48.26,12.06 54.61,12.06 55.24,12.7 R13.2
MCLR
  Top 0.305: SV2.4 0.64,42.55 | 0.64,42.55 0.64,55.24 R2.1 | U1.1 1.27,37.47 0.64,38.1 0.64,42.55
MISO
  Top 0.305: 14.61,26.14 J2.7 15.24,25.82 15.24,17.46 16.51,16.19 19.05,16.19 | R5.1 37.47,8.26 36.2,9.53 36.2,14.92 34.92,16.19 19.05,16.19 | J1.7 18.75,15.9 19.05,16.19
  Bottom 0.305: R5.1 42.55,8.26 43.81,9.53 43.81,16.51 44.45,17.14 51.44,17.14 52.07,17.78 52.07,19.68 52.7,20.32 64.14,20.32 65.41,21.59 65.41,26.04 Q1.G 63.5,25.4 Q1.S
MOSI  (via drill 0.66)
  Top 0.305: R8.2 R9.1 28.57,18.41 27.62,19.37 | 27.62,19.37 27.3,19.68 27.3,26.25 J2.2 | J1.3 23.16,14.27 v24.13,15.24 | v26.67,18.41 27.62,19.37
  Bottom 0.305: v24.13,15.24 24.13,15.88 v26.67,18.41
N$1
  Bottom 0.406: U7.1 85.09,27.3 83.19,25.4 83.19,22.86 84.45,21.59 XT1.1
N$2
  Bottom 0.406: U7.2 87.63,26.04 XT1.2
N$3
  Bottom 0.406: U5.6 69.22,50.8 67.94,49.53 67.94,41.27 67.31,40.64 C6.-
N$4
  Bottom 0.406: U5.2 79.38,50.8 78.74,50.16 74.3,50.16 73.03,48.9 73.03,41.66 C7.+
N$6
  Bottom 0.61: U7.3 90.17,13.97 88.9,12.7 B1.+@1 B1.+@2 B1.+@3 B1.+@4
N$12
  Bottom 0.305: C11.- 93.09,58.8 90.17,55.88 87.63,55.88 86.36,54.61 77.47,54.61 76.83,53.98 U5.3
N$13
  Bottom 0.305: C11.+ 93.34,56.52 91.44,54.61 87.63,54.61 85.72,52.7 U5.1
N$14
  Bottom 0.305: C10.+ 85.98,56.77 84.45,55.24 74.93,55.24 74.3,54.61 U5.4
N$15
  Bottom 0.305: C10.- 86.11,58.8 83.19,55.88 72.39,55.88 71.75,55.24 U5.5
N$16  (via drill 3.3 pad 5.08)
  other vias: 3.81,4.32
N$17  (via drill 3.3 pad 5.08)
  other vias: 3.81,73.85
N$18
  Bottom 0.305: R14.1 55.88,5.08 53.34,5.08 52.7,4.45 LED2.A
N$19
  Bottom 0.305: R13.1 53.34,7.62 50.8,5.08 46.35,5.08 45.72,4.45 LED1.A
N$20  (via drill 3.3 pad 5.08)
  other vias: 91.95,4.32
N$28
  Bottom 0.305: C2.2 XT2.1 38.73,32.51 U1.13
N$29
  Top 0.305: C3.2 XT2.2 41.27,34.8 U1.14
RTC
  Top 0.305: U1.35 20.95,51.44 23.5,48.9 41.27,48.9 42.55,50.16 42.55,54.61 43.18,55.24 46.99,55.24 47.62,54.61 47.62,50.8 48.9,49.53 61.59,49.53 62.87,48.26 74.93,48.26 75.56,47.62 75.56,40.64 R18.1
  Bottom 0.406: U7.7 87.63,34.92 87,34.29 80.64,34.29 80.01,34.92 R18.1
RTS
  Top 0.305: U5.11 69.22,43.5 68.58,42.86 26.99,42.86 26.04,41.91 U1.8
RX
  Top 0.305: U5.9 43.81,45.09 43.18,45.72 43.18,49.53 43.81,50.16 U1.26
SCL
  Top 0.305: R17.1 76.2,37.47 74.93,38.73 61.59,38.73 60.96,39.37 49.53,39.37 48.9,38.73 U1.17
  Bottom 0.406: U7.6 90.17,33.66 89.53,33.02 76.83,33.02 76.2,33.66 R17.1
SCLK  (via drill 0.66)
  Top 0.305: R6.2 R7.1 38.73,13.34 37.47,14.61 37.47,15.88 36.2,17.14 21.59,17.14 v21.27,17.46 19.68,19.05 19.68,26.23 J2.5 | J1.5 v20.95,14.61
  Bottom 0.305: v20.95,14.61 20.95,17.14 v21.27,17.46
SD_CD
  Top 0.305: J2.CD 11.86,24.34 12.7,23.5 12.7,20.95 12.06,20.32 R3.1
  Bottom 0.305: U1.37 15.88,50.8 14.61,49.53 14.61,34.92 13.97,34.29 13.02,34.29 11.43,32.7 11.43,30.48 5.71,24.77 R3.1
SD_CS  (via drill 0.66)
  Top 0.305: v45.72,19.68 46.99,20.95 R10.2 | J1.CD 16.55,13.29 15.88,13.97 13.97,13.97 v12.06,15.88
  Bottom 0.305: U1.7 23.5,36.2 21.59,34.29 21.59,20.95 | 21.59,20.95 22.86,19.68 v45.72,19.68 | v12.06,15.88 12.06,18.41 12.7,19.05 19.68,19.05 21.59,20.95
SD_WRPROT
  Top 0.305: J2.WP 10.66,28.71 10.16,29.21 8.89,29.21 3.17,23.5 R1.1
  Bottom 0.305: U1.38 13.34,50.8 12.06,49.53 12.06,34.61 10.48,33.02 10.48,30.8 3.17,23.5 R1.1
SDA
  Top 0.305: R16.1 72.39,36.83 71.75,37.47 59.69,37.47 57.78,35.56 46.99,35.56 46.35,36.2 U1.16
  Bottom 0.406: U7.5 92.71,33.02 91.44,31.75 73.03,31.75 72.39,32.38 R16.1
SPARE1
  Top 0.305: U2.17 TP2.TP
  Bottom 0.305: U2.17 TP2.TP 23.81,55.56 26.04,53.34 U1.33
SPARE2
  Bottom 0.305: U1.10 31.11,40.01 30.48,40.64 20.32,40.64 19.68,40.01 19.68,34.29 9.53,24.13 9.53,17.14 8.26,15.88 TP4.TP
SPI_CLK
  Bottom 0.305: U1.18 51.44,33.66 | 51.44,33.66 51.44,31.75 52.39,30.8 65.09,30.8 66.67,32.38 66.67,37.15 67.31,37.78 69.85,37.78 70.48,37.15 70.48,31.11 66.67,27.3 66.67,20.95 65.41,19.68 53.34,19.68 52.7,19.05 52.7,13.97 52.07,13.34 R7.2 | U6.11 69.22,55.24 68.58,54.61 62.87,54.61 62.23,53.98 62.23,38.1 59.69,35.56 59.69,34.29 59.05,33.66 51.44,33.66
SPI_SDI
  Bottom 0.305: U1.23 51.44,48.26 47.62,44.45 47.62,31.11 48.9,29.84 62.87,29.84 | 62.87,29.84 Q1.D | 62.87,29.84 66.67,29.84 68.58,31.75 R15.1
SPI_SDO
  Top 0.305: U6.14 76.83,55.88 76.2,55.24 49.53,55.24 48.9,54.61 U1.24
  Bottom 0.305: U1.24 48.9,48.26 45.09,44.45 45.09,35.56 44.45,34.92 43.18,34.92 41.91,33.66 41.91,30.48 48.9,23.5 48.9,19.05 49.53,18.41 R9.2
STAT_CS  (via drill 0.66)
  Top 0.305: v60.33,48.26 47.62,48.26 v46.99,48.9
  Bottom 0.305: U6.12 71.75,60.01 71.12,60.64 68.58,60.64 67.94,60.01 67.94,56.52 67.31,55.88 61.59,55.88 60.96,55.24 60.96,48.9 v60.33,48.26 | U1.15 43.81,45.72 v46.99,48.9
TX
  Top 0.305: U5.10 66.67,46.35 66.04,46.99 45.09,46.99 44.45,47.62 44.45,48.9 46.35,50.8 U1.25

### Text on the board
tPlace: 1 | TX | RX | CTS | RTS | GND
bPlace: 0 | +5V | TRS80 Hard Drive | Emulator V3.01 | (c) F. Vecoven | Eagle Layout | (c) FB Labs | 2014
tValues: LP2950